# EAGLE schematic RK08 (EAGLE 6.6.0)
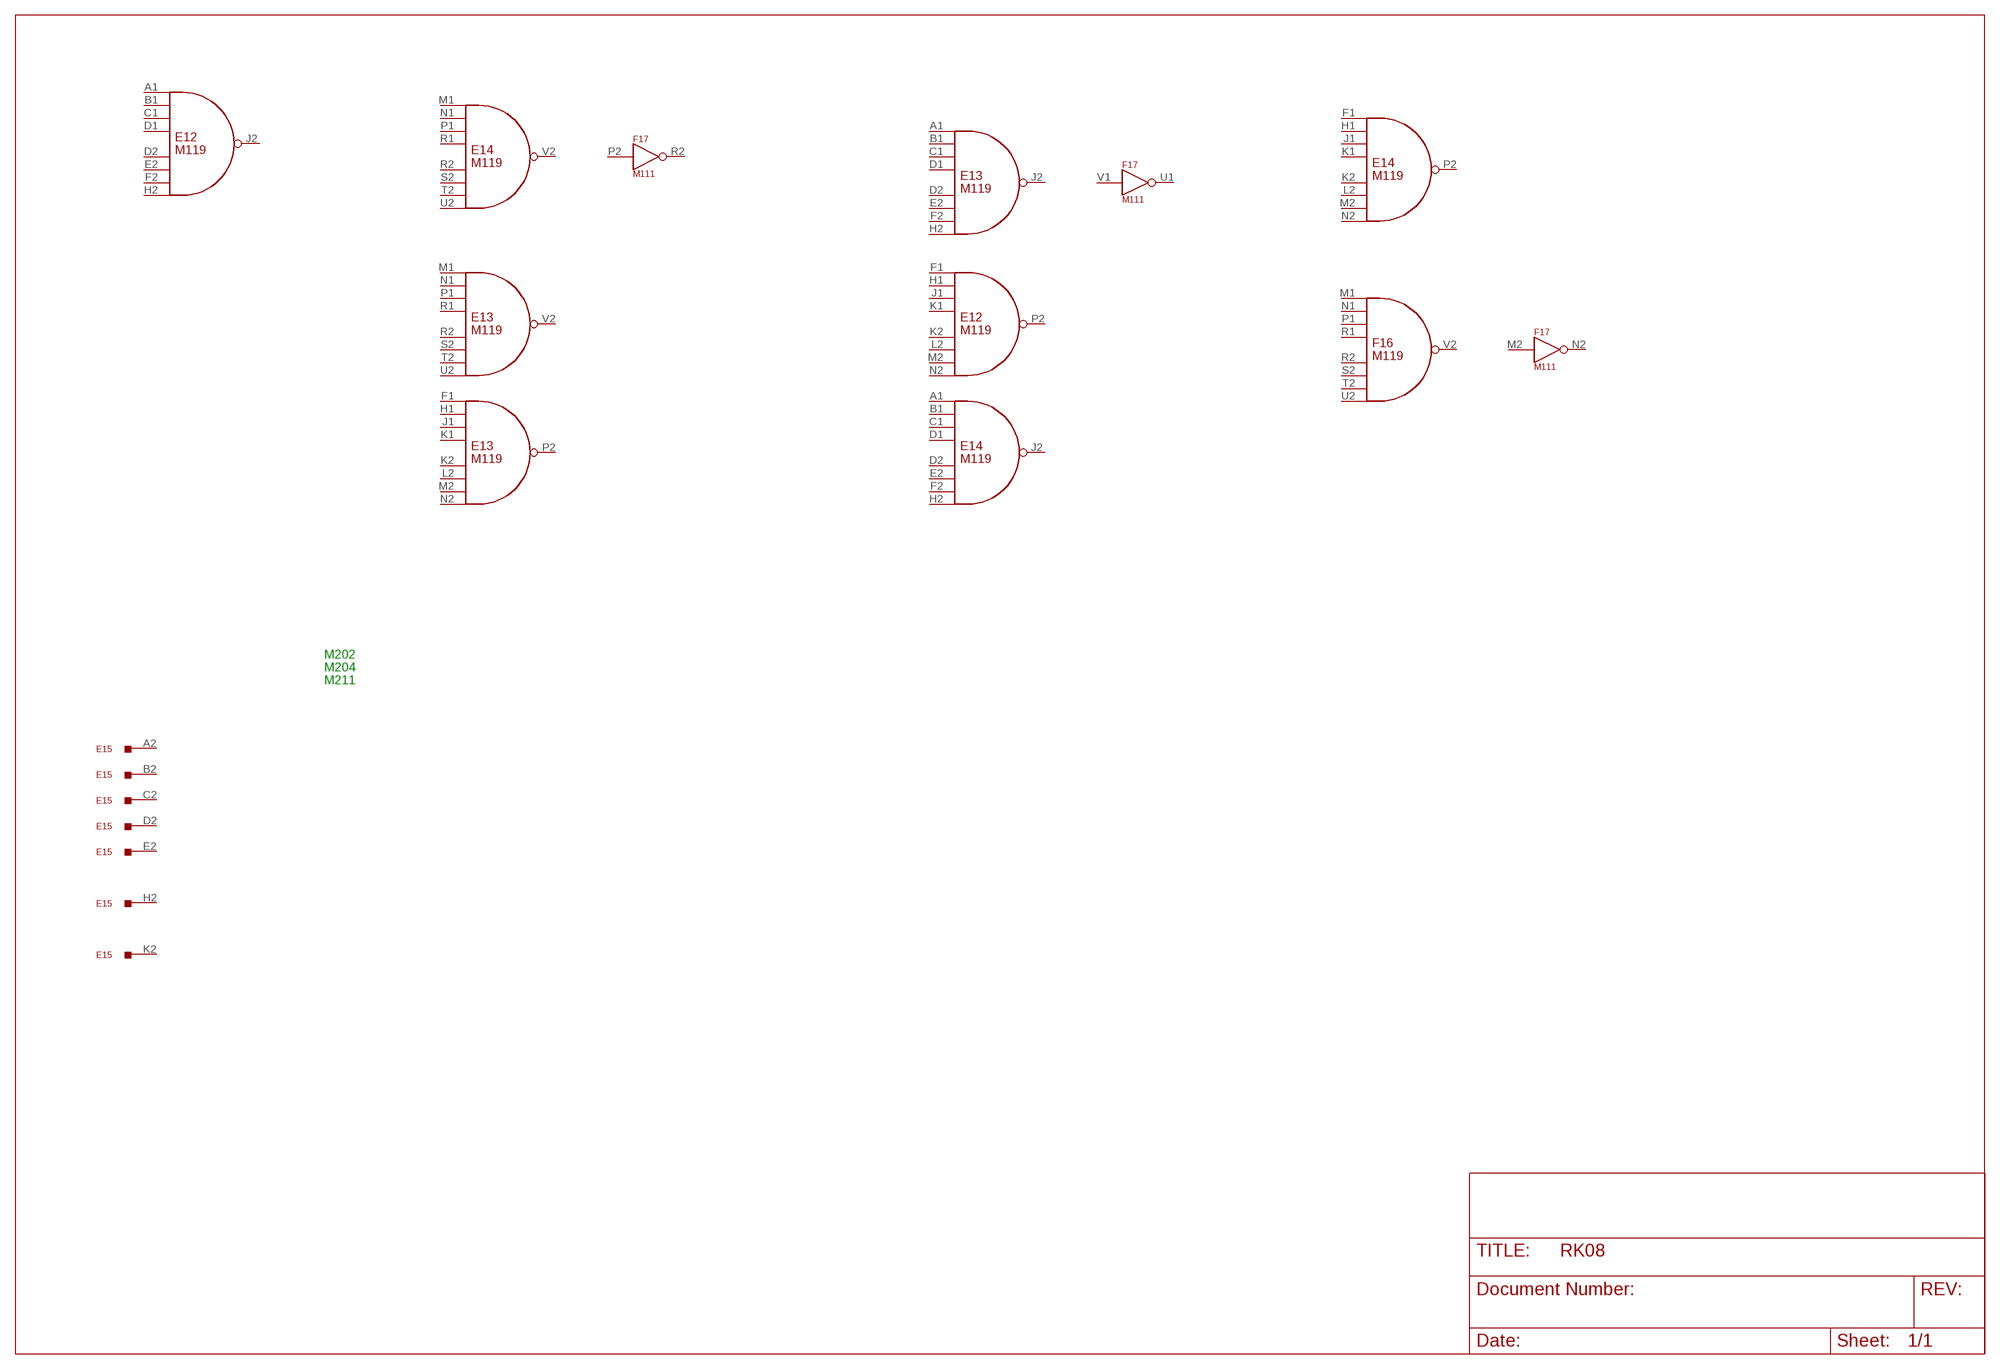
[diagram p0: schematic, sheet 1]

## Parts
E12  M119  [H807]
E13  M119  [H807]
E14  M119  [H807]
E15  M405  W023  [H807]
F16  M119  [H807]
F17  M111  [H807]
Unconnected: E12.A1(J2:IN1) E12.B1(J2:IN2) E12.C1(J2:IN3) E12.D1(J2:IN4) E12.D2(J2:IN5) E12.E2(J2:IN6) E12.F1(P2:IN1) E12.F2(J2:IN7) E12.H1(P2:IN2) E12.H2(J2:IN8) E12.J1(P2:IN3) E12.J2(J2:OUT) E12.K1(P2:IN4) E12.K2(P2:IN5) E12.L2(P2:IN6) E12.M1(V2:IN1) E12.M2(P2:IN7) E12.N1(V2:IN2) E12.N2(P2:IN8) E12.P1(V2:IN3) E12.P2(P2:OUT) E12.R1(V2:IN4) E12.R2(V2:IN5) E12.S2(V2:IN6) E12.T2(V2:IN7) E12.U1 E12.U2(V2:IN8) E12.V1 E12.V2(V2:OUT) E13.A1(J2:IN1) E13.B1(J2:IN2) E13.C1(J2:IN3) E13.D1(J2:IN4) E13.D2(J2:IN5) E13.E2(J2:IN6) E13.F1(P2:IN1) E13.F2(J2:IN7) E13.H1(P2:IN2) E13.H2(J2:IN8) E13.J1(P2:IN3) E13.J2(J2:OUT) E13.K1(P2:IN4) E13.K2(P2:IN5) E13.L2(P2:IN6) E13.M1(V2:IN1) E13.M2(P2:IN7) E13.N1(V2:IN2) E13.N2(P2:IN8) E13.P1(V2:IN3) E13.P2(P2:OUT) E13.R1(V2:IN4) E13.R2(V2:IN5) E13.S2(V2:IN6) E13.T2(V2:IN7) E13.U1 E13.U2(V2:IN8) E13.V1 E13.V2(V2:OUT) E14.A1(J2:IN1) E14.B1(J2:IN2) E14.C1(J2:IN3) E14.D1(J2:IN4) E14.D2(J2:IN5) E14.E2(J2:IN6) E14.F1(P2:IN1) E14.F2(J2:IN7) E14.H1(P2:IN2) E14.H2(J2:IN8) E14.J1(P2:IN3) E14.J2(J2:OUT) E14.K1(P2:IN4) E14.K2(P2:IN5) E14.L2(P2:IN6) E14.M1(V2:IN1) E14.M2(P2:IN7) E14.N1(V2:IN2) E14.N2(P2:IN8) E14.P1(V2:IN3) E14.P2(P2:OUT) E14.R1(V2:IN4) E14.R2(V2:IN5) E14.S2(V2:IN6) E14.T2(V2:IN7) E14.U1 E14.U2(V2:IN8) E14.V1 E14.V2(V2:OUT) E15.A2 E15.B2 E15.C2 E15.D2 E15.E2 E15.F2 E15.H2 E15.J2 E15.K2 E15.L2 E15.M2 E15.N2 E15.P2 E15.R2 E15.S2 E15.T2 E15.U2 E15.V2 F16.A1(J2:IN1) F16.B1(J2:IN2) F16.C1(J2:IN3) F16.D1(J2:IN4) F16.D2(J2:IN5) F16.E2(J2:IN6) F16.F1(P2:IN1) F16.F2(J2:IN7) F16.H1(P2:IN2) F16.H2(J2:IN8) F16.J1(P2:IN3) F16.J2(J2:OUT) F16.K1(P2:IN4) F16.K2(P2:IN5) F16.L2(P2:IN6) F16.M1(V2:IN1) F16.M2(P2:IN7) F16.N1(V2:IN2) F16.N2(P2:IN8) F16.P1(V2:IN3) F16.P2(P2:OUT) F16.R1(V2:IN4) F16.R2(V2:IN5) F16.S2(V2:IN6) F16.T2(V2:IN7) F16.U1 F16.U2(V2:IN8) F16.V1 F16.V2(V2:OUT) F17.A1(B1:IN) F17.B1(B1:OUT) F17.C1(D2:IN) F17.D1(E1:IN) F17.D2(D2:OUT) F17.E1(E1:OUT) F17.E2(F2:IN) F17.F1(H1:IN) F17.F2(F2:OUT) F17.H1(H1:OUT) F17.H2(J2:IN) F17.J1(K1:IN) F17.J2(J2:OUT) F17.K1(K1:OUT) F17.K2(L2:IN) F17.L1(M1:IN) F17.L2(L2:OUT) F17.M1(M1:OUT) F17.M2(N2:IN) F17.N1(P1:IN) F17.N2(N2:OUT) F17.P1(P1:OUT) F17.P2(R2:IN) F17.R1(S1:IN) F17.R2(R2:OUT) F17.S1(S1:OUT) F17.S2(T2:IN) F17.T2(T2:OUT) F17.U1(U1:OUT) F17.U2(V2:IN) F17.V1(U1:IN) F17.V2(V2:OUT)

## Notes on the sheet
- M202
- M204
- M211

## Power pins joined to a net without a drawn wire
GND: E12.C2(GND) E12.T1(GND) E13.C2(GND) E13.T1(GND) E14.C2(GND) E14.T1(GND) F16.C2(GND) F16.T1(GND) F17.C2(GND) F17.T1(GND)
VCC: E12.A2(VCC) E13.A2(VCC) E14.A2(VCC) F16.A2(VCC) F17.A2(VCC)

## Library data of the parts
E12-E14 F16 = dec-m:M119: 3 8-input NAND Gates
E15 = dec-m:W023: One-sided 18 pin connector/cable.
F17 = dec-m:M111: Sixteen inverters.